# Altium schematic sheet 03_Power.SchDoc
size A4; SheetNumber: 3; SheetTotal: 8
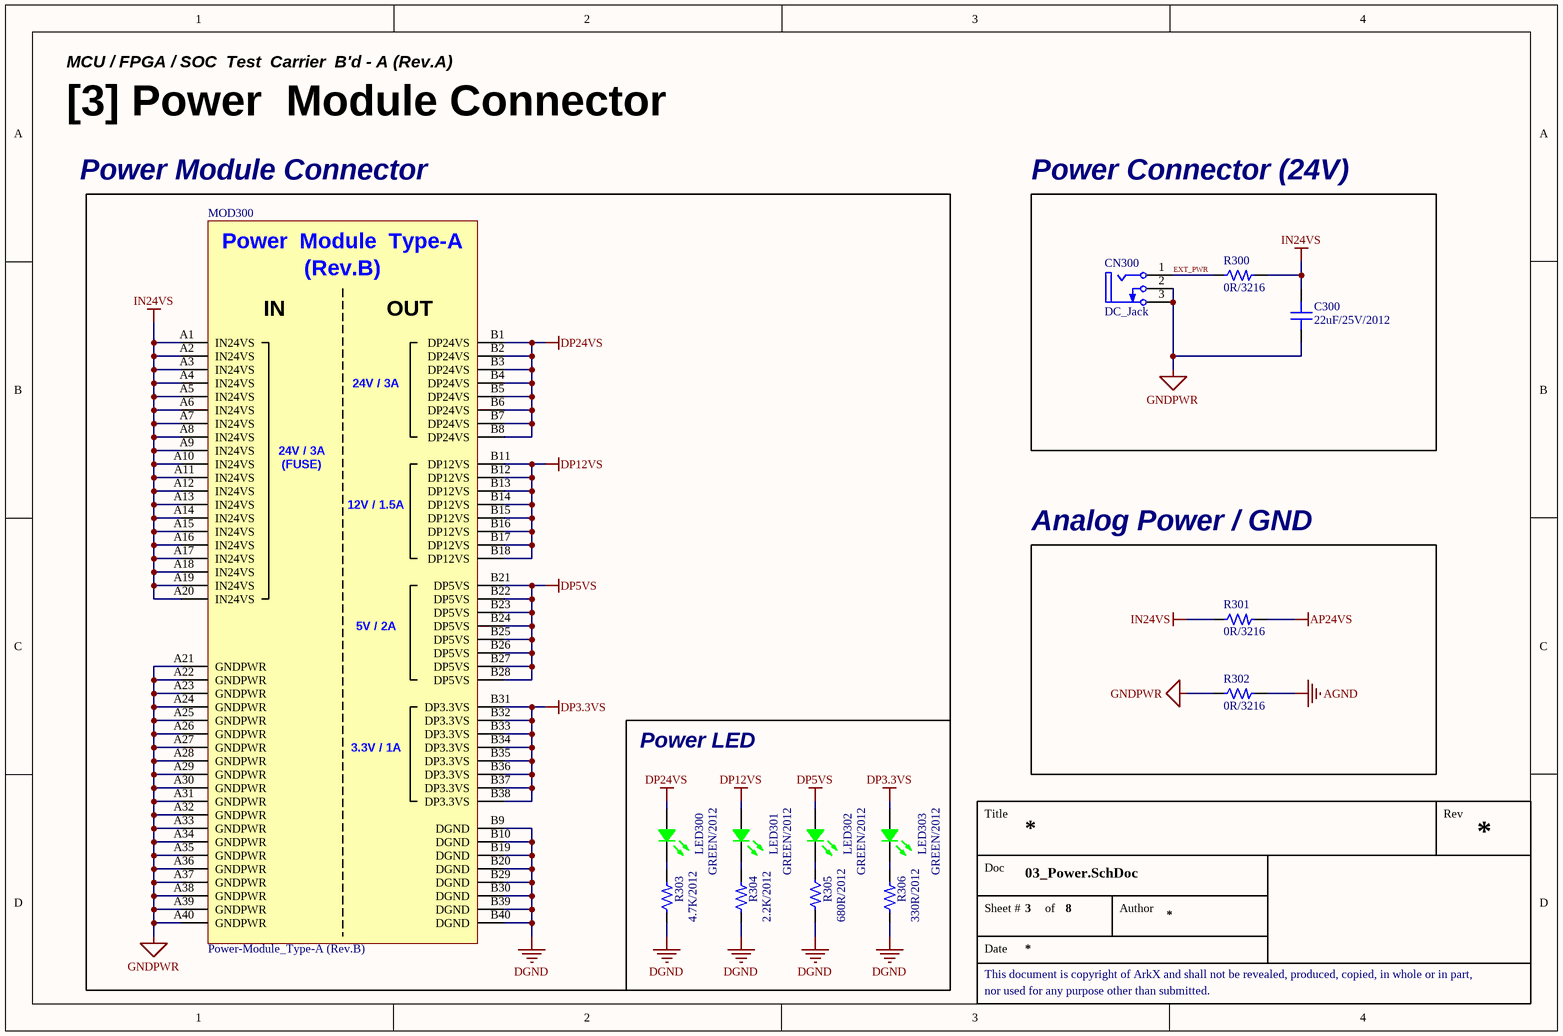
[diagram p0: 03_Power.SchDoc]

## Parts
C300  22uF/25V/2012  [CAP 2012 (0805_INCH)]
CN300  DC_Jack  [CON_DC-JACK]
LED300  GREEN/2012  [LED MHT170RGBCT (GREEN)]
LED301  GREEN/2012  [LED MHT170RGBCT (GREEN)]
LED302  GREEN/2012  [LED MHT170RGBCT (GREEN)]
LED303  GREEN/2012  [LED MHT170RGBCT (GREEN)]
MOD300  Power-Module_Type-A (Rev.B)  [MOD_Power-Module_Type-A (Rev.B)]
R300  0R/3216  [RES 3216 (1206_inch)]
R301  0R/3216  [RES 3216 (1206_inch)]
R302  0R/3216  [RES 3216 (1206_inch)]
R303  4.7K/2012  [RES 2012 (0805_inch)]
R304  2.2K/2012  [RES 2012 (0805_inch)]
R305  680R/2012  [RES 2012 (0805_inch)]
R306  330R/2012  [RES 2012 (0805_inch)]

## Blocks framed on the sheet
Power Connector (24V): C300 CN300 R300
Analog Power / GND: R301 R302
Power LED: LED300-LED303 R303-R306

## Nets
AGND: R302.2
AP24VS: R301.2
DGND: MOD300.B9(DGND) MOD300.B10(DGND) MOD300.B19(DGND) MOD300.B20(DGND) MOD300.B29(DGND) MOD300.B30(DGND) MOD300.B39(DGND) MOD300.B40(DGND) R303.1 R304.1 R305.2 R306.1
DP3.3VS: LED303.4(Common_Anode) MOD300.B31(DP3.3VS) MOD300.B32(DP3.3VS) MOD300.B33(DP3.3VS) MOD300.B34(DP3.3VS) MOD300.B35(DP3.3VS) MOD300.B36(DP3.3VS) MOD300.B37(DP3.3VS) MOD300.B38(DP3.3VS)
DP5VS: LED302.4(Common_Anode) MOD300.B21(DP5VS) MOD300.B22(DP5VS) MOD300.B23(DP5VS) MOD300.B24(DP5VS) MOD300.B25(DP5VS) MOD300.B26(DP5VS) MOD300.B27(DP5VS) MOD300.B28(DP5VS)
DP12VS: LED301.4(Common_Anode) MOD300.B11(DP12VS) MOD300.B12(DP12VS) MOD300.B13(DP12VS) MOD300.B14(DP12VS) MOD300.B15(DP12VS) MOD300.B16(DP12VS) MOD300.B17(DP12VS) MOD300.B18(DP12VS)
DP24VS: LED300.4(Common_Anode) MOD300.B1(DP24VS) MOD300.B2(DP24VS) MOD300.B3(DP24VS) MOD300.B4(DP24VS) MOD300.B5(DP24VS) MOD300.B6(DP24VS) MOD300.B7(DP24VS) MOD300.B8(DP24VS)
GNDPWR: C300.2 CN300.2(GND) CN300.3(GND) MOD300.A21(GNDPWR) MOD300.A22(GNDPWR) MOD300.A23(GNDPWR) MOD300.A24(GNDPWR) MOD300.A25(GNDPWR) MOD300.A26(GNDPWR) MOD300.A27(GNDPWR) MOD300.A28(GNDPWR) MOD300.A29(GNDPWR) MOD300.A30(GNDPWR) MOD300.A31(GNDPWR) MOD300.A32(GNDPWR) MOD300.A33(GNDPWR) MOD300.A34(GNDPWR) MOD300.A35(GNDPWR) MOD300.A36(GNDPWR) MOD300.A37(GNDPWR) MOD300.A38(GNDPWR) MOD300.A39(GNDPWR) MOD300.A40(GNDPWR) R302.1
IN24VS: C300.1 MOD300.A1(IN24VS) MOD300.A2(IN24VS) MOD300.A3(IN24VS) MOD300.A4(IN24VS) MOD300.A5(IN24VS) MOD300.A6(IN24VS) MOD300.A7(IN24VS) MOD300.A8(IN24VS) MOD300.A9(IN24VS) MOD300.A10(IN24VS) MOD300.A11(IN24VS) MOD300.A12(IN24VS) MOD300.A13(IN24VS) MOD300.A14(IN24VS) MOD300.A15(IN24VS) MOD300.A16(IN24VS) MOD300.A17(IN24VS) MOD300.A18(IN24VS) MOD300.A19(IN24VS) MOD300.A20(IN24VS) R300.2 R301.1
EXT_PWR: CN300.1(VCC) R300.1
NetLED300_2: LED300.2(GREEN) R303.2
NetLED301_2: LED301.2(GREEN) R304.2
NetLED302_2: LED302.2(GREEN) R305.1
NetLED303_2: LED303.2(GREEN) R306.2

## Notes on the sheet
- MCU / FPGA / SOC  Test  Carrier  B'd - A (Rev.A)
- [3] Power  Module Connector
- Power Module Connector
- Title
- Rev
- Doc
- Sheet #
- of
- Author
- This document is copyright of ArkX and shall not be revealed, produced, copied, in whole or in part,
- Date
- nor used for any purpose other than submitted.
- (in symbol MOD_Power-Module_Type-A (Rev.B)) Power  Module  Type-A; (Rev.B); IN; OUT; 24V / 3A; (FUSE); 12V / 1.5A; 5V / 2A; 3.3V / 1A

## Library data of the parts
C300 = CAP_22uF/25V/2012: Ceramic CAP_22uF/25V/2012; LCSC Part #: C45783; JLCPCB Part Type: Basic Part
CN300 = CON_DC-Jack: ComponentLink1Description: Manufacturer Link; ComponentLink1URL: http://www.cliffuk.co.uk/
LED300-LED303 = LED_MHT170RGBCT(GREEN): Colorless transparence -30℃~+85℃ Positive post Common anode RGB 120° 0805  Light Emitting Diodes (LED) ROHS; LCSC Part #: C2962094; JLCPCB Part Type: Extended Part
MOD300 = MOD_Power-Module_Type-A (Rev.B): Power-Module_(Type-A / Rev.B)
R300-R302 = RES_0R/3216/0.25W: Power Rating: 0.1W; Precision: 1%; Size: 1608; LCSC Part #: C17888; JLCPCB Part Type: Basic Part
R303 = RES_4.7K/2012/0.125W: Value: 4.7K; Power Rating: 0.125W; Precision: 1%; Size: 2012; LCSC Part #: C17673; JLCPCB Part Type: Basic Part
R304 = RES_2.2K/2012/0.125W: Value: 2.2K; Power Rating: 0.125W; Precision: 1%; Size: 2012; LCSC Part #: C17520; JLCPCB Part Type: Basic Part
R305 = RES_680R/2012/0.125W: Value: 680R; Power Rating: 0.125W; Precision: 1%; Size: 2012; LCSC Part #: C17798; JLCPCB Part Type: Basic Part
R306 = RES_330R/2012/0.125W: Value: 330R; Power Rating: 0.125W; Precision: 1%; Size: 2012; LCSC Part #: C17630; JLCPCB Part Type: Basic Part